# Altium schematic sheet System&Ports.SchDoc
size A4
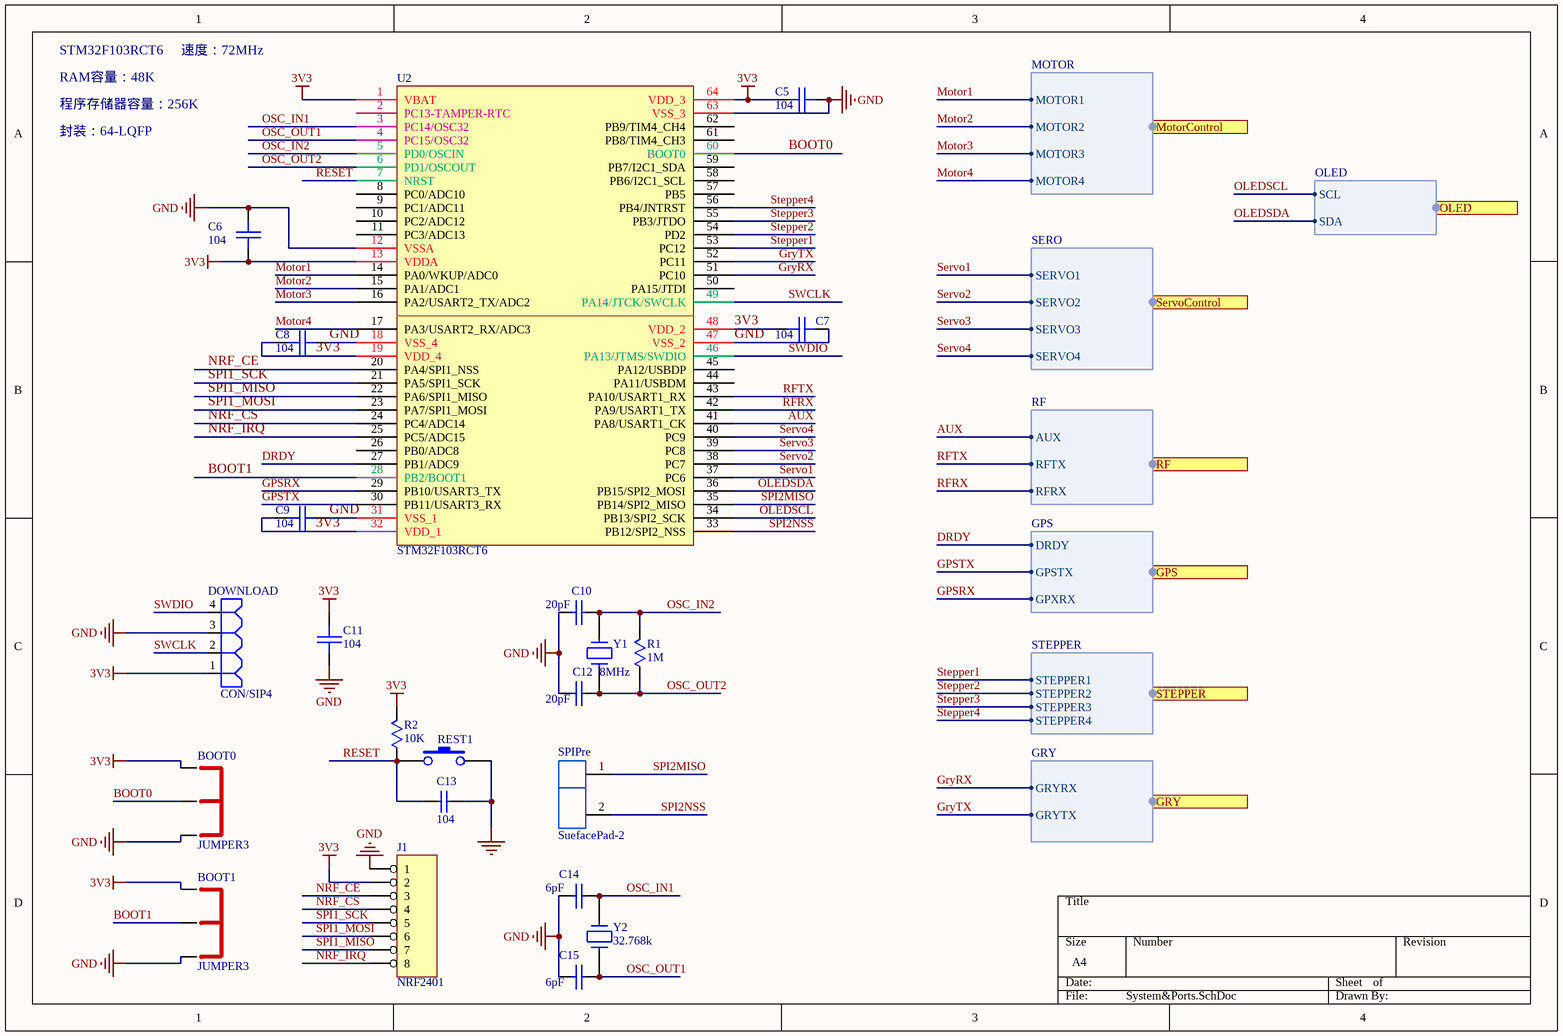
[diagram p0: System&Ports.SchDoc]

## Parts
BOOT0  JUMPER3  [Jumper3]
BOOT1  JUMPER3  [Jumper3]
C5  104  [C0603]
C6  104  [C0603]
C7  104  [C0603]
C8  104  [C0603]
C9  104  [C0603]
C10  20pF  [LC-0603_C]
C11  104  [C0603]
C12  20pF  [LC-0603_C]
C13  104  [LC-0603_C]
C14  6pF  [LC-0603_C]
C15  6pF  [LC-0603_C]
DOWNLOAD  CON/SIP4  [HDR1X4]
J1  NRF2401  [HDR2X4]
R1  1M  [LC-0603_R]
R2  10K  [R0603]
REST1  (no value)  [KEY-K2]
SPIPre  SuefacePad-2  [SurfacePad-2]
U2  STM32F103RCT6  [LC-LQFP-64_10x10x05P]
Y1  8MHz  [XTAL-49/S_N]
Y2  32.768k  [XTAL_2X6 卧式]

## Ports
GPS (harness GPS), GRY (harness GRY), MotorControl (harness MOTOR), OLED (harness OLED), RF (harness RF), ServoControl (harness SERO), STEPPER (harness STEPPER)

## Harnesses
MOTOR: MOTOR1, MOTOR2, MOTOR3, MOTOR4
SERO: SERVO1, SERVO2, SERVO3, SERVO4
RF: AUX, RFTX, RFRX
GPS: DRDY, GPSTX, GPXRX
STEPPER: STEPPER1, STEPPER2, STEPPER3, STEPPER4
GRY: GRYRX, GRYTX
OLED: SCL, SDA

## Nets
3V3: BOOT0.1 BOOT1.1 C5.1 C6.2 C7.1 C8.1 C9.1 C11.1 DOWNLOAD.1 J1.2 R2.2 U2.1(VBAT) U2.13(VDDA) U2.19(VDD_4) U2.32(VDD_1) U2.48(VDD_2) U2.64(VDD_3)
GND: BOOT0.3 BOOT1.3 C5.2 C6.1 C7.2 C8.2 C9.2 C10.1 C11.2 C12.1 C13.1 C14.1 C15.1 DOWNLOAD.3 J1.1 REST1.2 U2.12(VSSA) U2.18(VSS_4) U2.31(VSS_1) U2.47(VSS_2) U2.63(VSS_3)
AUX: U2.41(PA8/USART1_CK) ; port RF.AUX
BOOT0: BOOT0.2 U2.60(BOOT0)
BOOT1: BOOT1.2 U2.28(PB2/BOOT1)
DRDY: U2.27(PB1/ADC9) ; port GPS.DRDY
GPSRX: U2.29(PB10/USART3_TX) ; port GPS.GPXRX
GPSTX: U2.30(PB11/USART3_RX) ; port GPS.GPSTX
GryRX: U2.51(PC10) ; port GRY.GRYRX
GryTX: U2.52(PC11) ; port GRY.GRYTX
Motor1: U2.14(PA0/WKUP/ADC0) ; port MotorControl.MOTOR1
Motor2: U2.15(PA1/ADC1) ; port MotorControl.MOTOR2
Motor3: U2.16(PA2/USART2_TX/ADC2) ; port MotorControl.MOTOR3
Motor4: U2.17(PA3/USART2_RX/ADC3) ; port MotorControl.MOTOR4
NRF_CE: J1.3 U2.20(PA4/SPI1_NSS)
NRF_CS: J1.4 U2.24(PC4/ADC14)
NRF_IRQ: J1.8 U2.25(PC5/ADC15)
OLEDSCL: U2.34(PB13/SPI2_SCK) ; port OLED.SCL
OLEDSDA: U2.36(PB15/SPI2_MOSI) ; port OLED.SDA
OSC_IN1: C14.2 U2.3(PC14/OSC32) Y2.2
OSC_IN2: C10.2 R1.2 U2.5(PD0/OSCIN) Y1.1
OSC_OUT1: C15.2 U2.4(PC15/OSC32) Y2.1
OSC_OUT2: C12.2 R1.1 U2.6(PD1/OSCOUT) Y1.2
RESET: C13.2 R2.1 REST1.1 U2.7(NRST)
RFRX: U2.42(PA9/USART1_TX) ; port RF.RFRX
RFTX: U2.43(PA10/USART1_RX) ; port RF.RFTX
Servo1: U2.37(PC6) ; port ServoControl.SERVO1
Servo2: U2.38(PC7) ; port ServoControl.SERVO2
Servo3: U2.39(PC8) ; port ServoControl.SERVO3
Servo4: U2.40(PC9) ; port ServoControl.SERVO4
SPI1_MISO: J1.7 U2.22(PA6/SPI1_MISO)
SPI1_MOSI: J1.6 U2.23(PA7/SPI1_MOSI)
SPI1_SCK: J1.5 U2.21(PA5/SPI1_SCK)
SPI2MISO: SPIPre.1 U2.35(PB14/SPI2_MISO)
SPI2NSS: SPIPre.2 U2.33(PB12/SPI2_NSS)
Stepper1: U2.53(PC12) ; port STEPPER.STEPPER1
Stepper2: U2.54(PD2) ; port STEPPER.STEPPER2
Stepper3: U2.55(PB3/JTDO) ; port STEPPER.STEPPER3
Stepper4: U2.56(PB4/JNTRST) ; port STEPPER.STEPPER4
SWCLK: DOWNLOAD.2 U2.49(PA14/JTCK/SWCLK)
SWDIO: DOWNLOAD.4 U2.46(PA13/JTMS/SWDIO)

Not connected (* = marked no-connect by the designer): U2 2(PC13-TAMPER-RTC) 8(PC0/ADC10) 9(PC1/ADC11) 10(PC2/ADC12) 11(PC3/ADC13) 26(PB0/ADC8) 44(PA11/USBDM) 45(PA12/USBDP) 50(PA15/JTDI) 57(PB5) 58(PB6/I2C1_SCL) 59(PB7/I2C1_SDA) 61(PB8/TIM4_CH3) 62(PB9/TIM4_CH4)

## Notes on the sheet
- STM32F103RCT6
- 程序存储器容量：256K
- RAM容量：48K
- 速度：72MHz
- 封装：64-LQFP

## Library data of the parts
BOOT0 BOOT1 = JUMPER3: Jumper
C5-C9 C11 = CAP
C10 C12 = CAP: CAP CHIP 20P 50V(+-5% C0G 0603); Value: 20pF
C13 = CAP: GRM39 X7R102K50PT; Value: 100pF; Published: 8-Jun-2000; Revision: July-2002: Re-released for DXP Platform.; Publisher: Altium Limited; REF: GRM39 X7R102K50PT
C14 C15 = CAP: CAP CHIP 20P 50V(+-5% C0G 0603); Value: 20pF
J1 = HEADER 8: 8 Pin Header
R1 R2 = RES
REST1 = SW-PB
SPIPre = SurfacePad-2
U2 = STM32F103RBT6
Y1 Y2 = CRYSTAL: Crystal 8MHz PLUG; Value: 8MHz